# Altium schematic sheet CODEC.SchDoc
size Letter; CompanyName: Ploopy Corporation; Organization: Ploopy Corporation; Address1: Suite 226, 137-1140 Burnhamthorpe Road W; Address2: Mississauga; Address3: Ontario; Address4: Canada L5C 0A3; DocumentNumber: 2; Revision: R1.007; SheetNumber: 2; SheetTotal: 11
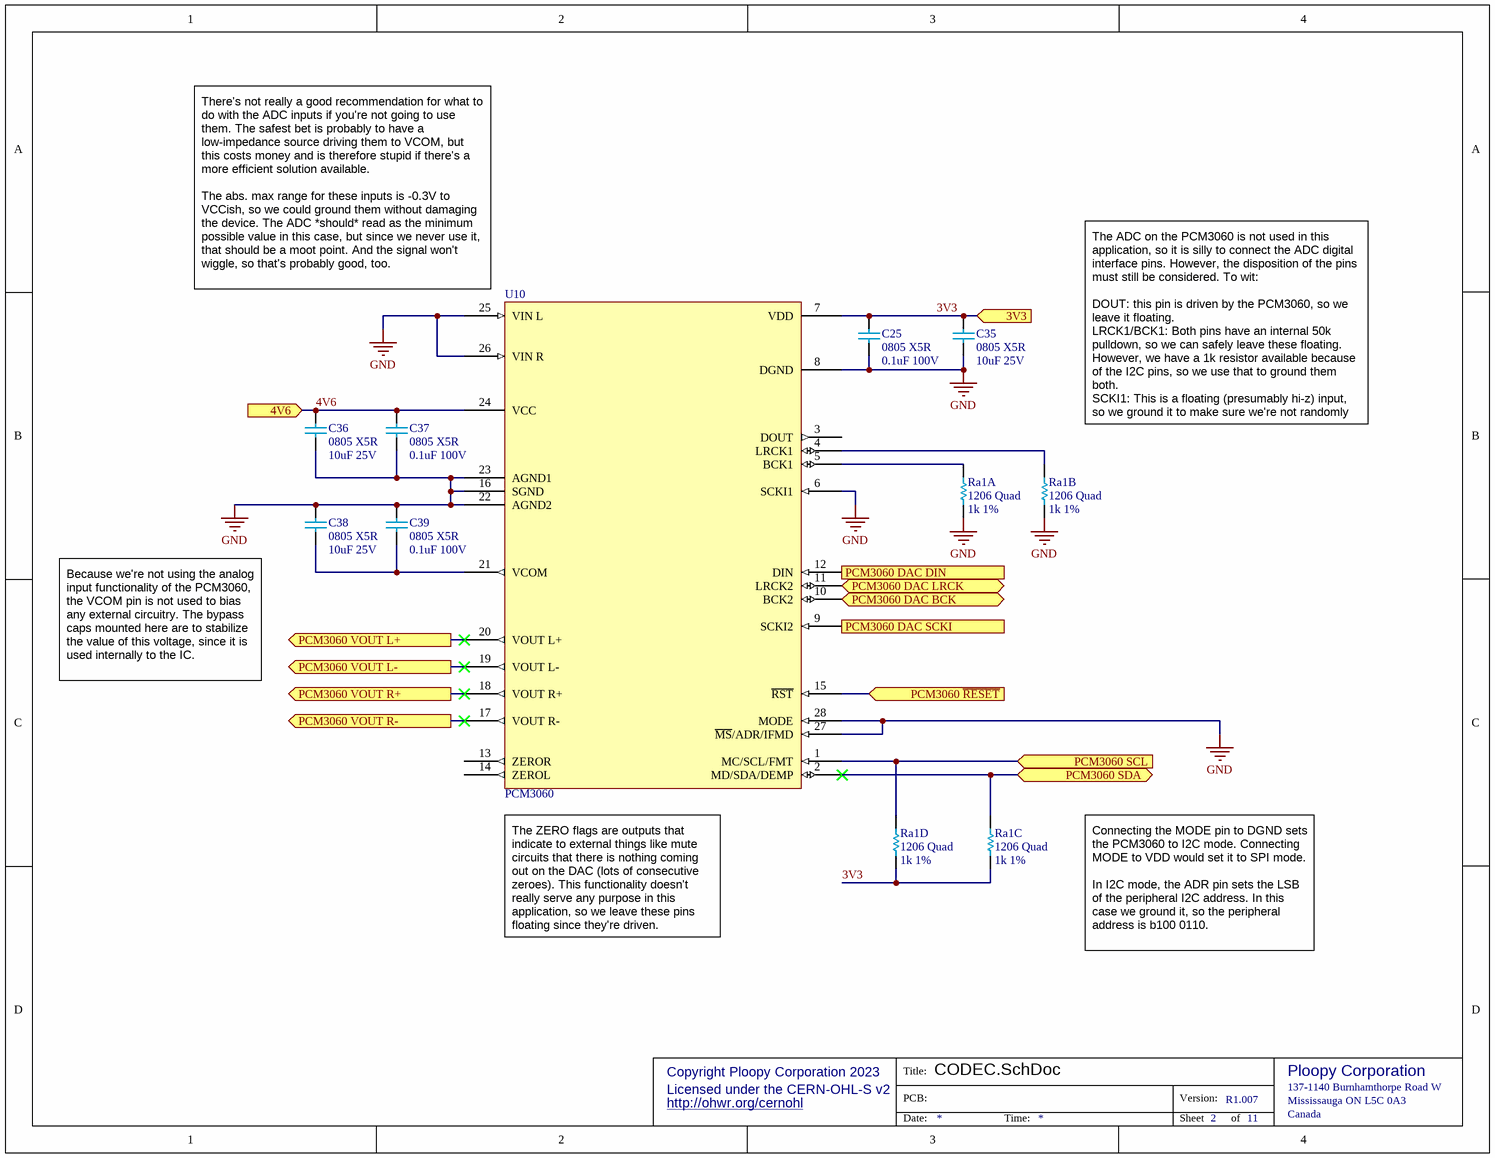
[diagram p0: CODEC.SchDoc]

## Parts
C25  0805 X5R  value 0.1uF 100V  [0805 - TALL]
C35  0805 X5R  value 10uF 25V  [0805 - TALL]
C36  0805 X5R  value 10uF 25V  [0805 - TALL]
C37  0805 X5R  value 0.1uF 100V  [0805 - TALL]
C38  0805 X5R  value 10uF 25V  [0805 - TALL]
C39  0805 X5R  value 0.1uF 100V  [0805 - TALL]
Ra1  1206 Quad  value 1k 1%  [4x 1k 1% - CAC-80P320X160-8M]  (parts A,B,C,D of 4)
U10  PCM3060  [PCM3060 - TSOP65P640X120-28M]

## Ports
3V3 (in), 4V6 (in), PCM3060 DAC BCK (bidir), PCM3060 DAC DIN (in), PCM3060 DAC LRCK (bidir), PCM3060 DAC SCKI (in), PCM3060 SCL (in), PCM3060 SDA (bidir), PCM3060 VOUT L+ (out), PCM3060 VOUT L- (out), PCM3060 VOUT R+ (out), PCM3060 VOUT R- (out), PCM3060 ~{RESET} (in)

## Nets
GND: C25.1 C35.1 C36.1 C37.1 C38.2 C39.2 Ra1.7 Ra1.8 U10.6(SCKI1) U10.8(DGND) U10.16(SGND) U10.22(AGND2) U10.23(AGND1) U10.25(VIN_L) U10.26(VIN_R) U10.27(~{MS}/ADR/IFMD) U10.28(MODE)
3V3: C25.2 C35.2 Ra1.5 Ra1.6 U10.7(VDD) ; port 3V3
4V6: C36.2 C37.2 U10.24(VCC) ; port 4V6
PCM3060 DAC BCK: U10.10(BCK2) ; port PCM3060 DAC BCK
PCM3060 DAC DIN: U10.12(DIN) ; port PCM3060 DAC DIN
PCM3060 DAC LRCK: U10.11(LRCK2) ; port PCM3060 DAC LRCK
PCM3060 DAC SCKI: U10.9(SCKI2) ; port PCM3060 DAC SCKI
PCM3060 ~{RESET}: U10.15(~{RST}) ; port PCM3060 ~{RESET}
PCM3060 SCL: Ra1.4 U10.1(MC/SCL/FMT) ; port PCM3060 SCL
PCM3060 SDA: Ra1.3 U10.2(MD/SDA/DEMP) ; port PCM3060 SDA
PCM3060 VOUT L+: U10.20(VOUT_L+) ; port PCM3060 VOUT L+
PCM3060 VOUT L-: U10.19(VOUT_L-) ; port PCM3060 VOUT L-
PCM3060 VOUT R+: U10.18(VOUT_R+) ; port PCM3060 VOUT R+
PCM3060 VOUT R-: U10.17(VOUT_R-) ; port PCM3060 VOUT R-
NetC38_1: C38.1 C39.1 U10.21(VCOM)
NetRa1_1: Ra1.1 U10.5(BCK1)
NetRa1_2: Ra1.2 U10.4(LRCK1)

Not connected (* = marked no-connect by the designer): U10 3(DOUT) 13(ZEROR) 14(ZEROL)

## Notes on the sheet
- (near U10) There's not really a good recommendation for what to do with the ADC inputs if you're not going to use them. The safest bet is probably to have a low-impedance source driving them to VCOM, but this costs money and is therefore stupid if there's a more efficient solution available.
  The abs. max range for these inputs is -0.3V to VCCish, so we could ground them without damaging the device. The ADC *should* read as the minimum possible value in this case, but since we never use it, that should be a moot point. And the signal won't wiggle, so that's probably good, too.
- The ADC on the PCM3060 is not used in this application, so it is silly to connect the ADC digital interface pins. However, the disposition of the pins must still be considered. To wit:
  DOUT: this pin is driven by the PCM3060, so we leave it floating.
  LRCK1/BCK1: Both pins have an internal 50k pulldown, so we can safely leave these floating. However, we have a 1k resistor available because of the I2C pins, so we use that to ground them both.
  SCKI1: This is a floating (presumably hi-z) input, so we ground it to make sure we're not randomly clocking the ADC interface.
- Because we're not using the analog input functionality of the PCM3060, the VCOM pin is not used to bias any external circuitry. The bypass caps mounted here are to stabilize the value of this voltage, since it is used internally to the IC.
- (near U10) The ZERO flags are outputs that indicate to external things like mute circuits that there is nothing coming out on the DAC (lots of consecutive zeroes). This functionality doesn't really serve any purpose in this application, so we leave these pins floating since they're driven.
- Connecting the MODE pin to DGND sets the PCM3060 to I2C mode. Connecting MODE to VDD would set it to SPI mode.
  In I2C mode, the ADR pin sets the LSB of the peripheral I2C address. In this case we ground it, so the peripheral address is b100 0110.
- Copyright Ploopy Corporation 2023
- Licensed under the CERN-OHL-S v2
- http://ohwr.org/cernohl
- Title:
- PCB:
- Version:
- Ploopy Corporation
- Mississauga ON L5C 0A3
- 137-1140 Burnhamthorpe Road W
- Date:
- Time:
- Sheet
- of
- Canada

## Library data of the parts
C25 C37 C39 = Cap 0.1uF 100V: 0805, X5R or better; Supplier 1: Digi-Key; Supplier Part Number 1: 1276-6840-2-ND
C35 C36 C38 = Cap 10uF 25V: 0805, X5R or better; Supplier 1: Mouser; Supplier Part Number 1: 81-GRM21BR61E106KA3L; Supplier 2: Digi-Key; Supplier Part Number 2: 490-5523-1-ND
Ra1 = Quad Res 1k 1% 1206: Chip resistor
U10 = PCM3060: 24-BIT, 96/192-kHz ASYNCHRONOUS STEREO AUDIO CODEC